# EAGLE schematic pid_demo (EAGLE 7.0.0)
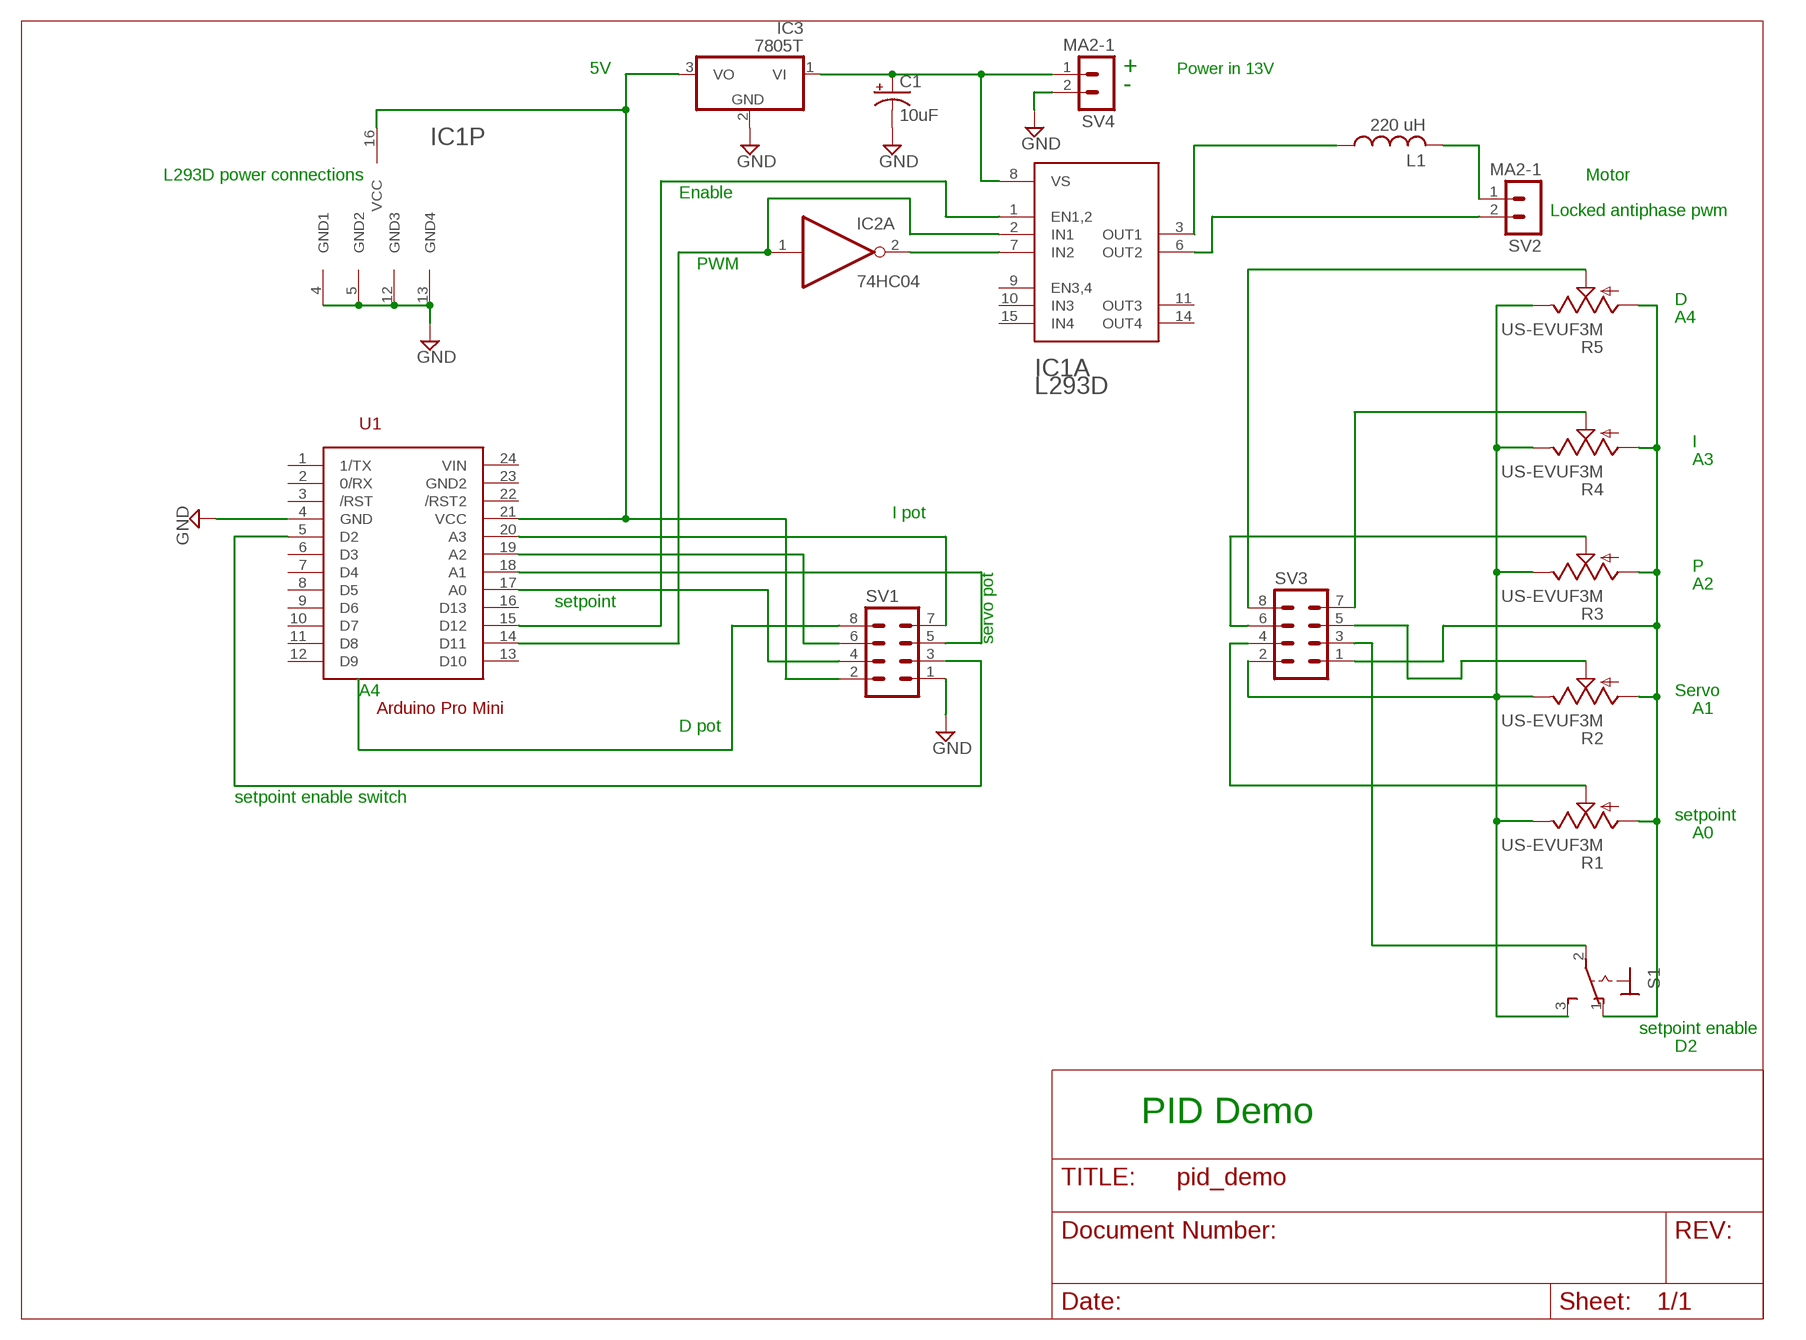
[diagram p0: schematic, sheet 1]

## Parts
C1  10uF  CPOL-USE5-5  [E5-5]
IC1  L293D  [DIP16]
IC2  74HC04  74ALS04N  [DIL14]
IC3  7805T  [TO220H]
L1  220 uH  L-USTJ4-U1  [TJ4-U1]
R1  US-EVUF3M  [EVUFXM]
R2  US-EVUF3M  [EVUFXM]
R3  US-EVUF3M  [EVUFXM]
R4  US-EVUF3M  [EVUFXM]
R5  US-EVUF3M  [EVUFXM]
S1  320-916  [320-916]
SV1  MA04-2  [MA04-2]
SV2  MA2-1  [MA02-1]
SV3  MA04-2  [MA04-2]
SV4  MA2-1  [MA02-1]
U1  Arduino Pro Mini  ARDUINO_PRO_MINI  [DIL24]

## Nets
GND: C1.- IC1.4(P:GND1) IC1.5(P:GND2) IC1.12(P:GND3) IC1.13(P:GND4) IC3.2(GND) SV1.1 SV4.2 U1.4(GND)
N$1: R1.1(A) R2.1(A) R3.1(A) R4.1(A) R5.1(A) S1.1(O) SV3.1
N$2: R1.3(E) R2.3(E) R3.3(E) R4.3(E) R5.3(E) S1.3(S) SV3.2
N$3: IC1.3(A:OUT1) L1.1
N$4: SV1.5 U1.18(A1)
N$5: S1.2(P) SV3.3
N$6: R1.2(S) SV3.4
N$7: R2.2(S) SV3.5
N$8: R3.2(S) SV3.6
N$9: R4.2(S) SV3.7
N$10: R5.2(S) SV3.8
N$11: L1.2 SV2.1
N$12: SV1.6 U1.19(A2)
N$13: SV1.4 U1.17(A0)
N$14: SV1.3 U1.5(D2)
N$15: SV1.7 U1.20(A3)
N$16: SV1.8
N$17: IC1.16(P:VCC) IC3.3(VO) SV1.2 U1.21(VCC)
N$18: IC1.6(A:OUT2) SV2.2
N$19: IC1.7(A:IN2) IC2.2(A:O)
N$20: IC1.2(A:IN1) IC2.1(A:I) U1.14(D11)
N$21: C1.+ IC1.8(A:VS) IC3.1(VI) SV4.1
N$22: IC1.1(A:EN1,2) U1.15(D12)
Unconnected: IC1.9(A:EN3,4) IC1.10(A:IN3) IC1.11(A:OUT3) IC1.14(A:OUT4) IC1.15(A:IN4) IC2.3(B:I) IC2.4(B:O) IC2.5(C:I) IC2.6(C:O) IC2.8(D:O) IC2.9(D:I) IC2.10(E:O) IC2.11(E:I) IC2.12(F:O) IC2.13(F:I) U1.1(1/TX) U1.2(0/RX) U1.3(/RST) U1.6(D3) U1.7(D4) U1.8(D5) U1.9(D6) U1.10(D7) U1.11(D8) U1.12(D9) U1.13(D10) U1.16(D13) U1.22(/RST2) U1.23(GND2) U1.24(VIN)

## Notes on the sheet
- 5V | + | Power in 13V
- -
- L293D power connections | Motor
- Enable
- Locked antiphase pwm
- PWM
- D
- A4
- I
- A3
- I pot
- servo pot | P
- A2
- setpoint
- A4 | Servo
- A1
- D pot
- setpoint enable switch
- setpoint
- A0
- setpoint enable
- D2
- PID Demo

## Power pins joined to a net without a drawn wire
GND: IC2.7(P:GND)
VCC: IC2.14(P:VCC)

## Library data of the parts
C1 = rcl:CPOL-US: POLARIZED CAPACITOR, American symbol
IC1 = ads2:L293D
IC2 = 74xx-us:74*04: Hex INVERTER
IC3 = linear:78*: Positive VOLTAGE REGULATOR Source: http://cache.national.com/ds/LM/LM78L05.pdf http://www.fairchildsemi.com/ds/LM/LM7805.pdf
L1 = rcl:L-US: INDUCTOR, American symbol
R1-R5 = pot:US-EVU: 9 mm Square Rotary Potentiometers Source: Panasonic
S1 = switch:320-916: TOGGLE SWITCH distributor RS Components
SV1 SV3 = con-lstb:MA04-2: PIN HEADER; OC_FARNELL: unknown; OC_NEWARK: unknown
SV2 SV4 = custom:MA2-1
U1 = custom:ARDUINO_PRO_MINI